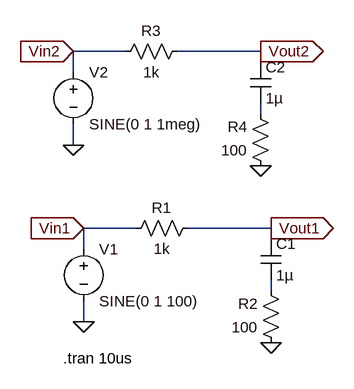
[diagram p0: schematic Prob_1b.asc]
Prob_1b.asc, the LTspice schematic file:
Version 4
SHEET 1 880 680
WIRE 128 -240 48 -240
WIRE 336 -240 208 -240
WIRE 336 -224 336 -240
WIRE 48 -208 48 -240
WIRE 336 -144 336 -160
WIRE 48 -96 48 -128
WIRE 144 32 64 32
WIRE 352 32 224 32
WIRE 352 48 352 32
WIRE 64 64 64 32
WIRE 352 128 352 112
WIRE 64 176 64 144
FLAG 64 176 0
FLAG 352 208 0
FLAG 64 32 Vin1
IOPIN 64 32 In
FLAG 352 32 Vout1
IOPIN 352 32 Out
FLAG 48 -96 0
FLAG 336 -64 0
FLAG 48 -240 Vin2
IOPIN 48 -240 In
FLAG 336 -240 Vout2
IOPIN 336 -240 Out
SYMBOL voltage 64 48 R0
WINDOW 123 0 0 Left 0
WINDOW 39 0 0 Left 0
SYMATTR InstName V1
SYMATTR Value SINE(0 1 100)
SYMBOL res 240 16 R90
WINDOW 0 0 56 VBottom 2
WINDOW 3 32 56 VTop 2
SYMATTR InstName R1
SYMATTR Value 1k
SYMBOL res 368 224 R180
WINDOW 0 36 76 Left 2
WINDOW 3 36 40 Left 2
SYMATTR InstName R2
SYMATTR Value 100
SYMBOL cap 336 48 R0
SYMATTR InstName C1
SYMATTR Value 1µ
SYMBOL voltage 48 -224 R0
WINDOW 123 0 0 Left 0
WINDOW 39 0 0 Left 0
SYMATTR InstName V2
SYMATTR Value SINE(0 1 1meg)
SYMBOL res 224 -256 R90
WINDOW 0 0 56 VBottom 2
WINDOW 3 32 56 VTop 2
SYMATTR InstName R3
SYMATTR Value 1k
SYMBOL res 352 -48 R180
WINDOW 0 36 76 Left 2
WINDOW 3 36 40 Left 2
SYMATTR InstName R4
SYMATTR Value 100
SYMBOL cap 320 -224 R0
SYMATTR InstName C2
SYMATTR Value 1µ
TEXT 32 232 Left 2 !.tran 10us

The netlist it stands for:
* Prob_1b.asc
V1 Vin1 0 SINE(0 1 100)
R1 Vout1 Vin1 1k
R2 0 N002 100
C1 Vout1 N002 1µ
V2 Vin2 0 SINE(0 1 1meg)
R3 Vout2 Vin2 1k
R4 0 N001 100
C2 Vout2 N001 1µ
.tran 10us
.backanno
.end

* Results of the author's LTspice run, read from the files saved beside the schematic
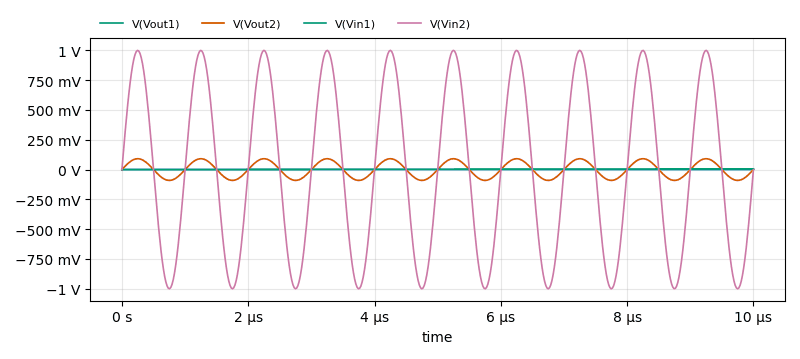
[diagram p1: Transient Analysis of Prob_1b.asc, plotted from the saved traces]
* Transient Analysis, 1 run:
*   V(Vout1): min 0 V, max 597.1 µV, average 294.2 µV, rms 341 µV, last 597.1 µV
*   V(Vout2): min -90.69 mV, max 90.95 mV, average 130.9 µV, rms 64.23 mV, last -1.19 µV
*   V(Vin1): min 0 V, max 6.283 mV, average 3.142 mV, rms 3.628 mV, last 6.283 mV
*   V(Vin2): min -1 V, max 1 V, average 0 V, rms 707.1 mV, last 0 V